# Altium schematic sheet main.SchDoc
size A3; SheetNumber: 1; SheetTotal: 4
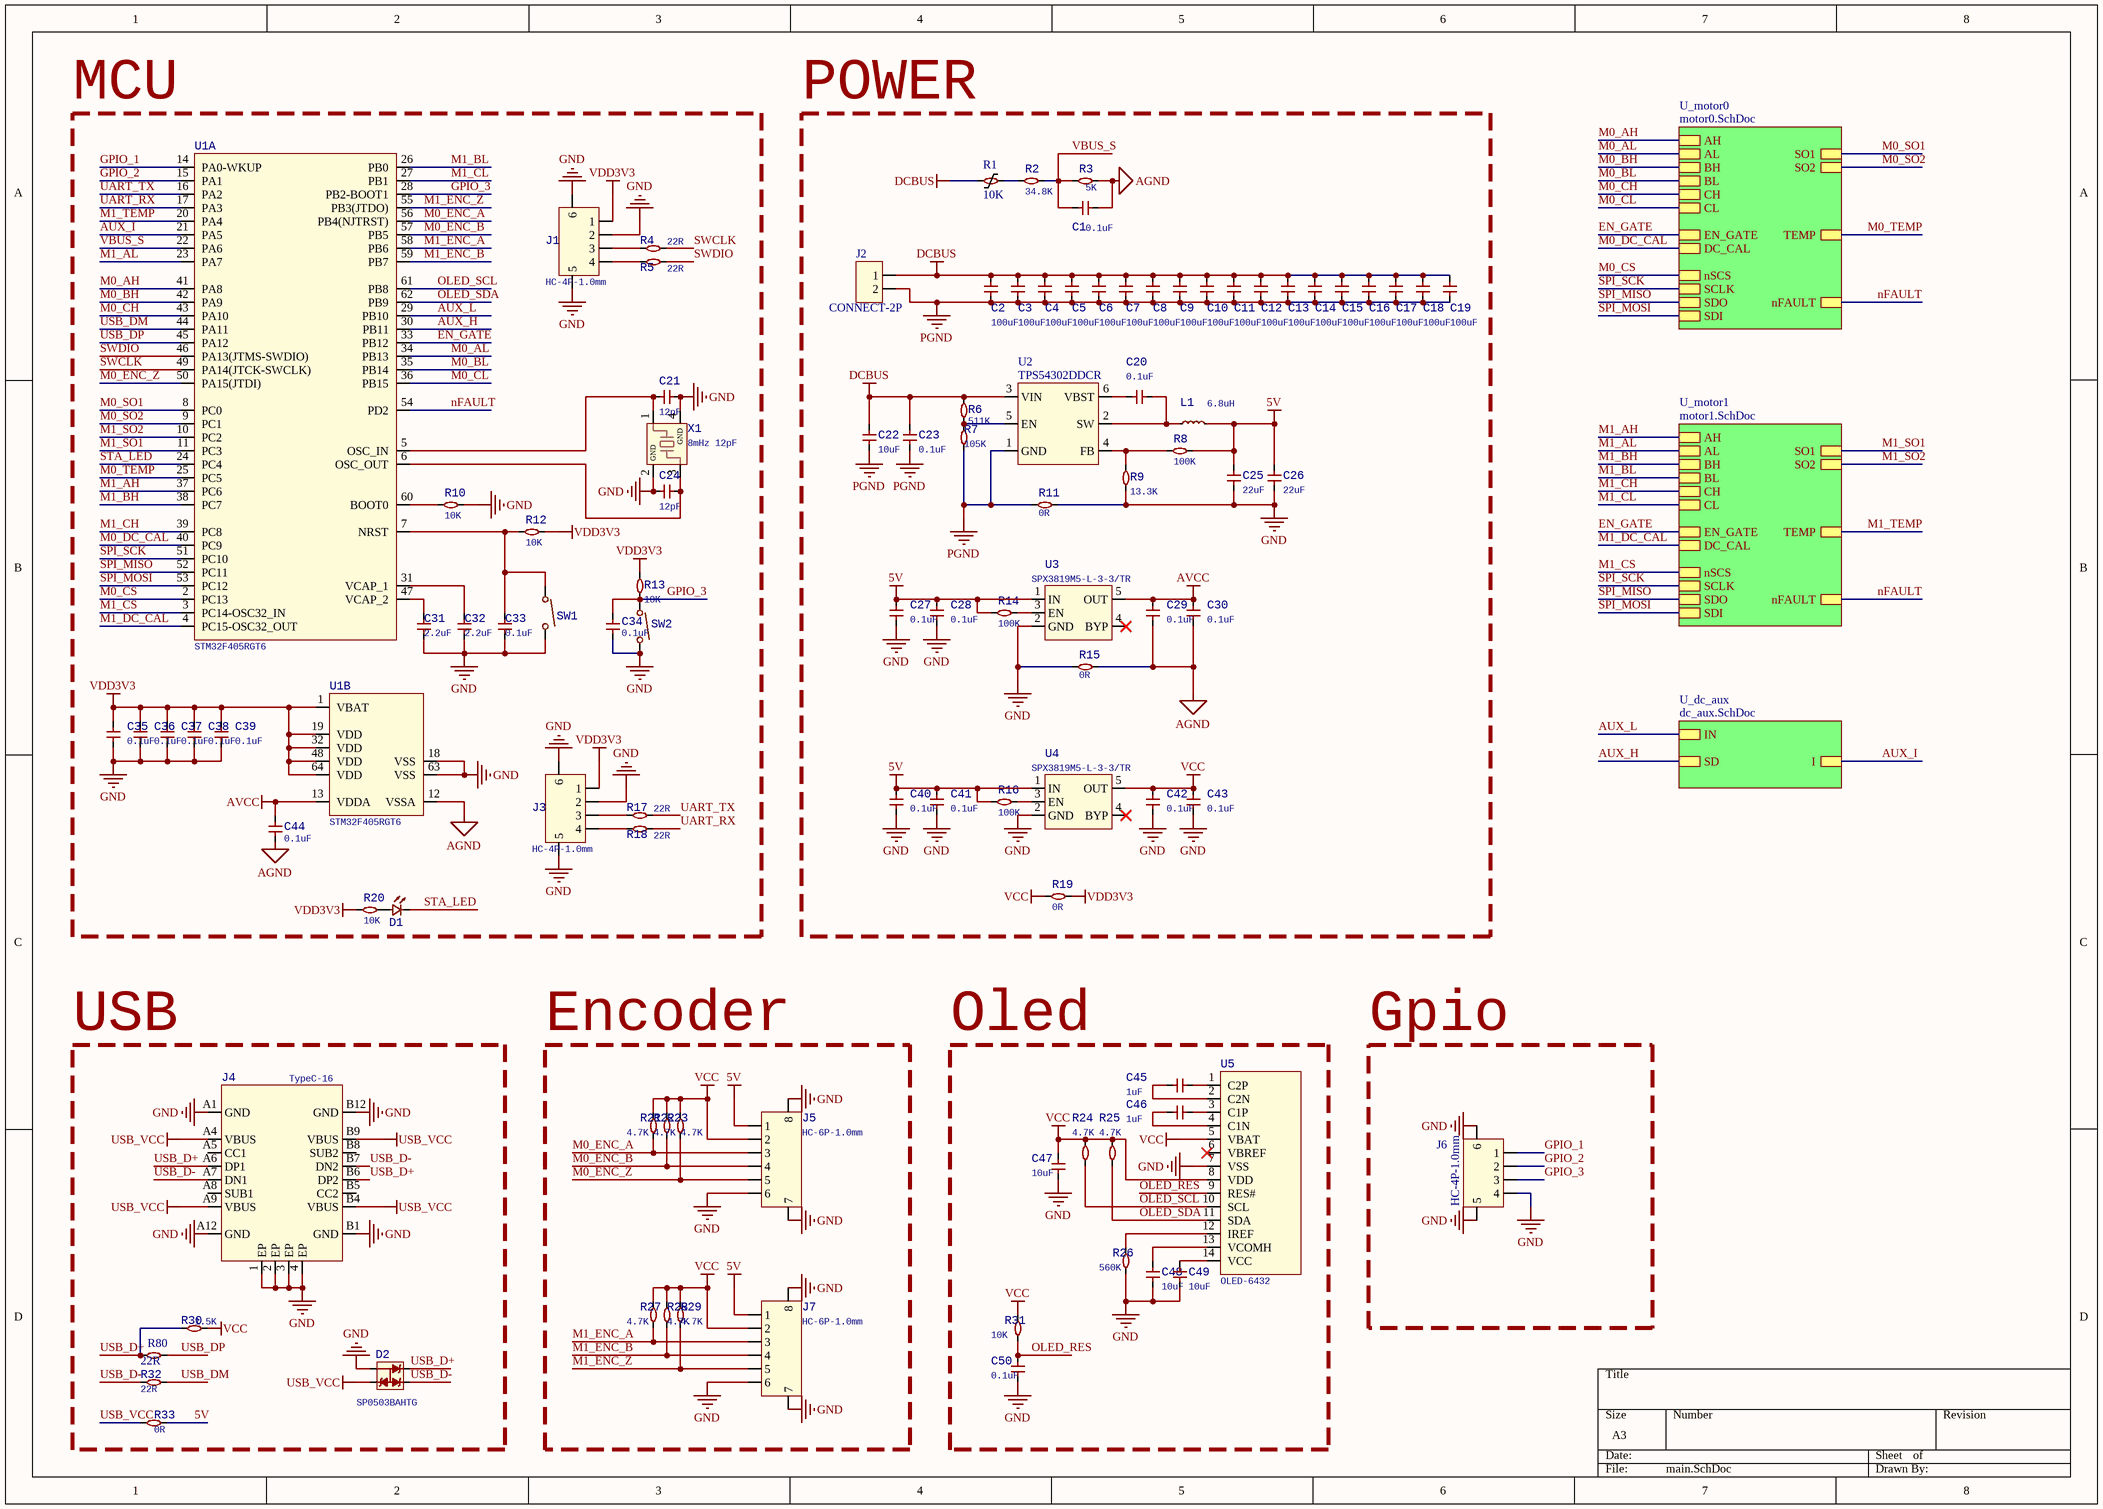
[diagram p0: main.SchDoc]

## Parts
C1  0.1uF  [C0402]
C2  100uF  [C1206]
C3  100uF  [C1206]
C4  100uF  [C1206]
C5  100uF  [C1206]
C6  100uF  [C1206]
C7  100uF  [C1206]
C8  100uF  [C1206]
C9  100uF  [C1206]
C10  100uF  [C1206]
C11  100uF  [C1206]
C12  100uF  [C1206]
C13  100uF  [C1206]
C14  100uF  [C1206]
C15  100uF  [C1206]
C16  100uF  [C1206]
C17  100uF  [C1206]
C18  100uF  [C1206]
C19  100uF  [C1206]
C20  0.1uF  [C0402]
C21  12pF  [C0402]
C22  10uF  [C0402]
C23  0.1uF  [C0402]
C24  12pF  [C0402]
C25  22uF  [C0805]
C26  22uF  [C0805]
C27  0.1uF  [C0402]
C28  0.1uF  [C0402]
C29  0.1uF  [C0402]
C30  0.1uF  [C0402]
C31  2.2uF  [C0402]
C32  2.2uF  [C0402]
C33  0.1uF  [C0402]
C34  0.1uF  [C0402]
C35  0.1uF  [C0402]
C36  0.1uF  [C0402]
C37  0.1uF  [C0402]
C38  0.1uF  [C0402]
C39  0.1uF  [C0402]
C40  0.1uF  [C0402]
C41  0.1uF  [C0402]
C42  0.1uF  [C0402]
C43  0.1uF  [C0402]
C44  0.1uF  [C0402]
C45  1uF  [C0402]
C46  1uF  [C0402]
C47  10uF  [C0402]
C48  10uF  [C0402]
C49  10uF  [C0402]
C50  0.1uF  [C0402]
D1  LED  [LED-0402]  (value not drawn)
D2  SP0503BAHTG  [SOT-143]
J1  HC-4P-1.0mm  [SMD_4P_HC-1.0]
J2  CONNECT-2P  [CONNECT--EP-2P]
J3  HC-4P-1.0mm  [SMD_4P_HC-1.0]
J4  TypeC-16  [USB-SMD_TYPE-C-16P]
J5  HC-6P-1.0mm  [SMD_6P_HC-1.0]
J6  HC-4P-1.0mm  [SMD_4P_HC-1.0]
J7  HC-6P-1.0mm  [SMD_6P_HC-1.0]
L1  6.8uH  [L1008]
R1  10K  [R0402]
R2  34.8K  [R0402]
R3  5K  [R0402]
R4  22R  [R0402]
R5  22R  [R0402]
R6  511K  [R0402]
R7  105K  [R0402]
R8  100K  [R0402]
R9  13.3K  [R0402]
R10  10K  [R0402]
R11  0R  [R0402]
R12  10K  [R0402]
R13  10K  [R0402]
R14  100K  [R0402]
R15  0R  [R0402]
R16  100K  [R0402]
R17  22R  [R0402]
R18  22R  [R0402]
R19  0R  [R0402]
R20  10K  [R0402]
R21  4.7K  [R0402]
R22  4.7K  [R0402]
R23  4.7K  [R0402]
R24  4.7K  [R0402]
R25  4.7K  [R0402]
R26  560K  [R0402]
R27  4.7K  [R0402]
R28  4.7K  [R0402]
R29  4.7K  [R0402]
R30  1.5K  [R0402]
R31  10K  [R0402]
R32  22R  [R0402]
R33  0R  [R0402]
R80  22R  [R0402]
SW1  3*4两脚按键  [SW-SMD_L4.0-W2.9]  (value not drawn)
SW2  3*4两脚按键  [SW-SMD_L4.0-W2.9]  (value not drawn)
U1  STM32F405RGT6  [LQFP-64_L10.0-W10.0-P0.50]  (parts A,B of 2)
U2  TPS54302DDCR  [SOT-23-6]
U3  SPX3819M5-L-3-3/TR  [SOT-23-5]
U4  SPX3819M5-L-3-3/TR  [SOT-23-5]
U5  OLED-6432  [OLED-0.96-128x64]
X1  8mHz 12pF  [SMD2016-4P]

## Blocks framed on the sheet
MCU: C21 C24 C31-C39 C44 D1 J1 J3 R4 R5 R10 R12 R13 R17 R18 R20 SW1 SW2 U1 X1
POWER: C1-C20 C22 C23 C25-C30 C40-C43 J2 L1 R1-R3 R6-R9 R11 R14-R16 R19 U2-U4
USB: D2 J4 R30 R32 R33 R80
Encoder: J5 J7 R21-R23 R27-R29
Oled: C45-C50 R24-R26 R31 U5
Gpio: J6

## Sub-sheets
U_dc_aux = dc_aux.SchDoc: IN, SD, I
U_motor0 = motor0.SchDoc: SO2, CL, SO1, CH, BL, BH, AL, AH, EN_GATE, DC_CAL, SCLK, SDO, SDI, nSCS, nFAULT, TEMP
U_motor1 = motor1.SchDoc: SO2, CL, SO1, CH, BL, BH, AL, AH, EN_GATE, DC_CAL, SCLK, SDO, SDI, nSCS, nFAULT, TEMP

## Nets
5V: C25.1 C26.1 C27.1 C28.1 C40.1 C41.1 J5.1 J7.1 L1.2 R8.2 R14.2 R16.2 R33.2 U3.1(IN) U4.1(IN)
AGND: C1.2 C29.2 C30.2 C44.2 R3.1 R15.1 U1.12(VSSA)
AVCC: C29.1 C30.1 C44.1 U1.13(VDDA) U3.5(OUT)
DCBUS: C2.1 C3.1 C4.1 C5.1 C6.1 C7.1 C8.1 C9.1 C10.1 C11.1 C12.1 C13.1 C14.1 C15.1 C16.1 C17.1 C18.1 C19.1 C22.1 C23.1 J2.1 R1.2 R6.2 U2.3(VIN)
GND: C21.2 C24.2 C25.2 C26.2 C27.2 C28.2 C31.2 C32.2 C33.1 C34.1 C35.2 C36.2 C37.2 C38.2 C39.2 C40.2 C41.2 C42.2 C43.2 C47.2 C48.2 C49.2 C50.2 D2.1 J1.2 J1.5 J1.6 J3.2 J3.5 J3.6 J4.1(EP) J4.2(EP) J4.3(EP) J4.4(EP) J4.A1(GND) J4.A12(GND) J4.B1(GND) J4.B12(GND) J5.6 J5.7 J5.8 J6.4 J6.5 J6.6 J7.6 J7.7 J7.8 R9.1 R10.2 R11.1 R15.2 R26.1 SW1.2 SW2.2 U1.18(VSS) U1.63(VSS) U3.2(GND) U4.2(GND) U5.7(VSS) X1.2(GND) X1.4(GND)
PGND: C2.2 C3.2 C4.2 C5.2 C6.2 C7.2 C8.2 C9.2 C10.2 C11.2 C12.2 C13.2 C14.2 C15.2 C16.2 C17.2 C18.2 C19.2 C22.2 C23.2 J2.2 R7.2 R11.2 U2.1(GND)
USB_VCC: D2.2 J4.A4(VBUS) J4.A9(VBUS) J4.B4(VBUS) J4.B9(VBUS) R33.1
VCC: C42.1 C43.1 C47.1 J5.2 J7.2 R19.1 R21.2 R22.2 R23.2 R24.2 R25.2 R27.2 R28.2 R29.2 R30.2 R31.2 U4.5(OUT) U5.5(VBAT) U5.8(VDD)
VDD3V3: C35.1 C36.1 C37.1 C38.1 C39.1 J1.1 J3.1 R12.2 R13.2 R19.2 R20.1 U1.1(VBAT) U1.19(VDD) U1.32(VDD) U1.48(VDD) U1.64(VDD)
AUX_H: U1.30(PB11) ; sheet U_dc_aux/SD
AUX_I: U1.21(PA5) ; sheet U_dc_aux/I
AUX_L: U1.29(PB10) ; sheet U_dc_aux/IN
EN_GATE: U1.33(PB12) ; sheet U_motor1/EN_GATE, sheet U_motor0/EN_GATE
GPIO_1: J6.1 U1.14(PA0-WKUP)
GPIO_2: J6.2 U1.15(PA1)
GPIO_3: C34.2 J6.3 R13.1 SW2.1 U1.28(PB2-BOOT1)
M0_AH: U1.41(PA8) ; sheet U_motor0/AH
M0_AL: U1.34(PB13) ; sheet U_motor0/AL
M0_BH: U1.42(PA9) ; sheet U_motor0/BH
M0_BL: U1.35(PB14) ; sheet U_motor0/BL
M0_CH: U1.43(PA10) ; sheet U_motor0/CH
M0_CL: U1.36(PB15) ; sheet U_motor0/CL
M0_CS: U1.2(PC13) ; sheet U_motor0/nSCS
M0_DC_CAL: U1.40(PC9) ; sheet U_motor0/DC_CAL
M0_ENC_A: J5.3 R21.1 U1.56(PB4(NJTRST))
M0_ENC_B: J5.4 R22.1 U1.57(PB5)
M0_ENC_Z: J5.5 R23.1 U1.50(PA15(JTDI))
M0_SO1: U1.8(PC0) ; sheet U_motor0/SO1
M0_SO2: U1.9(PC1) ; sheet U_motor0/SO2
M0_TEMP: U1.25(PC5) ; sheet U_motor0/TEMP
M1_AH: U1.37(PC6) ; sheet U_motor1/AH
M1_AL: U1.23(PA7) ; sheet U_motor1/AL
M1_BH: U1.38(PC7) ; sheet U_motor1/BH
M1_BL: U1.26(PB0) ; sheet U_motor1/BL
M1_CH: U1.39(PC8) ; sheet U_motor1/CH
M1_CL: U1.27(PB1) ; sheet U_motor1/CL
M1_CS: U1.3(PC14-OSC32_IN) ; sheet U_motor1/nSCS
M1_DC_CAL: U1.4(PC15-OSC32_OUT) ; sheet U_motor1/DC_CAL
M1_ENC_A: J7.3 R27.1 U1.58(PB6)
M1_ENC_B: J7.4 R28.1 U1.59(PB7)
M1_ENC_Z: J7.5 R29.1 U1.55(PB3(JTDO))
M1_SO1: U1.11(PC3) ; sheet U_motor1/SO1
M1_SO2: U1.10(PC2) ; sheet U_motor1/SO2
M1_TEMP: U1.20(PA4) ; sheet U_motor1/TEMP
nFAULT: U1.54(PD2) ; sheet U_motor1/nFAULT, sheet U_motor0/nFAULT
OLED_RES: C50.1 R31.1 U5.9(RES#)
OLED_SCL: R24.1 U1.61(PB8) U5.10(SCL)
OLED_SDA: R25.1 U1.62(PB9) U5.11(SDA)
SPI_MISO: U1.52(PC11) ; sheet U_motor1/SDO, sheet U_motor0/SDO
SPI_MOSI: U1.53(PC12) ; sheet U_motor1/SDI, sheet U_motor0/SDI
SPI_SCK: U1.51(PC10) ; sheet U_motor1/SCLK, sheet U_motor0/SCLK
STA_LED: D1.1 U1.24(PC4)
SWCLK: R4.2 U1.49(PA14(JTCK-SWCLK))
SWDIO: R5.2 U1.46(PA13(JTMS-SWDIO))
UART_RX: R18.2 U1.17(PA3)
UART_TX: R17.2 U1.16(PA2)
USB_D+: D2.4 J4.A6(DP1) J4.B6(DP2) R30.1 R80.1
USB_D-: D2.3 J4.A7(DN1) J4.B7(DN2) R32.1
USB_DM: R32.2 U1.44(PA11)
USB_DP: R80.2 U1.45(PA12)
VBUS_S: C1.1 R2.1 R3.2 U1.22(PA6)
NetC20_1: C20.1 L1.1 U2.2(SW)
NetC20_2: C20.2 U2.6(VBST)
NetC21_1: C21.1 U1.5(OSC_IN) X1.1
NetC24_1: C24.1 U1.6(OSC_OUT) X1.3
NetC31_1: C31.1 U1.47(VCAP_2)
NetC32_1: C32.1 U1.31(VCAP_1)
NetC33_2: C33.2 R12.1 SW1.1 U1.7(NRST)
NetC45_1: C45.1 U5.1(C2P)
NetC45_2: C45.2 U5.2(C2N)
NetC46_1: C46.1 U5.3(C1P)
NetC46_2: C46.2 U5.4(C1N)
NetC48_1: C48.1 U5.13(VCOMH)
NetC49_1: C49.1 U5.14(VCC)
NetD1_2: D1.2 R20.2
NetJ1_3: J1.3 R4.1
NetJ1_4: J1.4 R5.1
NetJ3_3: J3.3 R17.1
NetJ3_4: J3.4 R18.1
NetR1_1: R1.1 R2.2
NetR6_1: R6.1 R7.1 U2.5(EN)
NetR8_1: R8.1 R9.2 U2.4(FB)
NetR10_1: R10.1 U1.60(BOOT0)
NetR14_1: R14.1 U3.3(EN)
NetR16_1: R16.1 U4.3(EN)
NetR26_2: R26.2 U5.12(IREF)

Not connected (* = marked no-connect by the designer): J4 A5(CC1) A8(SUB1) B5(CC2) B8(SUB2); U3 4(BYP)*; U4 4(BYP)*; U5 6(VBREF)*

## Library data of the parts
C1-C50 = CAP: 贴片电容; Manufacturer: SAMSUNG(三星); Manufacturer Part: CL05A105KP5NNND; Add into BOM: yes; Tolerance: ±10%; Voltage Rated: 10V; Temperature Coefficient: X5R; Symbol: CAP-0402; Device: cap-0402; LCSC Part Name: 1uF ±10% 10V; Supplier Part: C307414; Supplier Footprint: 0402; JLCPCB Part Class: Extended Part; Datasheet: https://atta.szlcsc.com/upload/public/pdf/source/20181009/C307414_0A02B57115E94FED95F0CB1E32115BFC.pdf; Supplier: LCSC; Convert to PCB: yes
D1 = LED: 贴片发光二极管; Manufacturer: SAMSUNG(三星); Manufacturer Part: CL05A105KP5NNND; Add into BOM: yes; Tolerance: ±10%; Voltage Rated: 10V; Temperature Coefficient: X5R; Symbol: CAP-0402; Device: cap-0402; LCSC Part Name: 1uF ±10% 10V; Supplier Part: C307414; Supplier Footprint: 0402; JLCPCB Part Class: Extended Part; Datasheet: https://atta.szlcsc.com/upload/public/pdf/source/20181009/C307414_0A02B57115E94FED95F0CB1E32115BFC.pdf; Supplier: LCSC; Convert to PCB: yes
D2 = SP0503BAHTG: USB-三组 瞬态移植二极管
J1 J3 J6 = HC-4P-1.0mm: 线对板连接器
J2 = CONNECT-2P: 连接器
J4 = TypeC-16P: Type-C母座; 触点数量:16; Manufacturer: kinghelm(金航标); Symbol: KH-TYPE-C-16P; Add into BOM: yes; Connector Type: Type-C; Gender: 母座; Number of Contacts: 16; Number of Ports: 1; Current Rating - Power (Max): 3A; LCSC Part Name: Type-C 母座 卧贴; Supplier Part: C709357; Manufacturer Part: KH-TYPE-C-16P; Supplier Footprint: SMD; Datasheet: https://atta.szlcsc.com/upload/public/pdf/source/20200911/C709357_AA8DCEB38BB20E3035A7ED7AE7667837.pdf; Supplier: LCSC; Convert to PCB: yes; Standard: -; Mounting Style: 卧贴; Operating Temperature Range: -40~+85; JLCPCB Part Class: Extended Part
J5 J7 = HC-6P-1.0mm: 线对板连接器
L1 = IND: 贴片电感
R1 = NTC: 热敏电阻; Manufacturer: UNI-ROYAL(厚声); Manufacturer Part: 0402WGF1001TCE; Add into BOM: yes; Tolerance: ±1%; Power(Watts): 1/16W; Temperature Coefficient: ±100ppm/; Overload Voltage (Max): 50V; Symbol: RES-0402; Device: res-0402; LCSC Part Name: 1k ±1%; Supplier Part: C11702; Supplier Footprint: 0402; Datasheet: https://atta.szlcsc.com/upload/public/pdf/source/20200306/C422600_1E6D84923E4A46A82E41ADD87F860B5C.pdf; Supplier: LCSC; Convert to PCB: yes; Type: 厚膜电阻; Operating Temperature Range: -55~+155; JLCPCB Part Class: 基础库
R2-R33 R80 = RES: 贴片电阻; Manufacturer: UNI-ROYAL(厚声); Manufacturer Part: 0402WGF1001TCE; Add into BOM: yes; Tolerance: ±1%; Power(Watts): 1/16W; Temperature Coefficient: ±100ppm/; Overload Voltage (Max): 50V; Symbol: RES-0402; Device: res-0402; LCSC Part Name: 1k ±1%; Supplier Part: C11702; Supplier Footprint: 0402; Datasheet: https://atta.szlcsc.com/upload/public/pdf/source/20200306/C422600_1E6D84923E4A46A82E41ADD87F860B5C.pdf; Supplier: LCSC; Convert to PCB: yes; Type: 厚膜电阻; Operating Temperature Range: -55~+155; JLCPCB Part Class: 基础库
SW1 SW2 = Switch: 3*4两脚贴片不带柱; Manufacturer: BRIGHT(博瑞泰); Symbol: TSA343G00-250J2; Device: 3*4两脚按键不带柱; Add into BOM: yes; Contact Current: 50mA; Voltage Rating (DC): 12V; Insulation Resistance: 100M; Circuit: 单刀单掷; Actuator Style: 圆形按钮; Actuator/Cap Color: 黑色; With Lamp: 无; Operating Force: 250gf@±50gf; Mechanical Life: 50000; Pin Style: SMD接片; Switch Length: 3.95mm; Switch Width: 2.9mm; Switch Height: 2mm; Strike Gundam: 否; LCSC Part Name: 3*4 两脚小龟不带柱  250gf; Supplier Part: C354946; Manufacturer Part: TSA343G00-250J2; Supplier Footprint: SMD; Datasheet: https://atta.szlcsc.com/upload/public/pdf/source/20190426/C354946_6B70DFBDFA823D17B8EB46FB9599F693.pdf; Supplier: LCSC; Convert to PCB: yes; Mounting Style: 立贴; Operating Temperature: -25~+70; JLCPCB Part Class: Extended Part
U1 = STM32F405RGT6: ST,MCU,CPU内核：ARM Cortex-M4 CPU最大主频：168MHz 程序存储容量：512KB 程序存储器类型：FLASH RAM总容量：192KB
U2 = TPS54302DDCR: 降压DCDC / 输入4.5~28V / 输出596mV~28V / 3A
U3 U4 = SPX3819M5-L-3-3/TR: LDO输入电压:16V;输出电压:3.3V; Manufacturer: MaxLinear; Add into BOM: yes; Output Type: 固定; Output Polarity: 正; Number of Outputs: 1; Maximum Input Voltage: 16V; Output Voltage: 3.3V; Dropout Voltage: 700mV@(500mA); Output Current: 500mA; Power Supply Rejection Ratio (PRSS): 70dB; Symbol: SPX3819M5-L-3-3/TR; LCSC Part Name: Vin=16V Vout=3.3V 500mA 70dB; Supplier Part: C9055; Manufacturer Part: SPX3819M5-L-3-3/TR; Supplier Footprint: SOT-23-5; Datasheet: https://atta.szlcsc.com/upload/public/pdf/source/20160421/1461205045150.pdf; Supplier: LCSC; Convert to PCB: yes; JLCPCB Part Class: Extended Part
U5 = OLED
X1 = XTAL: 无源晶振  频率公差：±10ppm